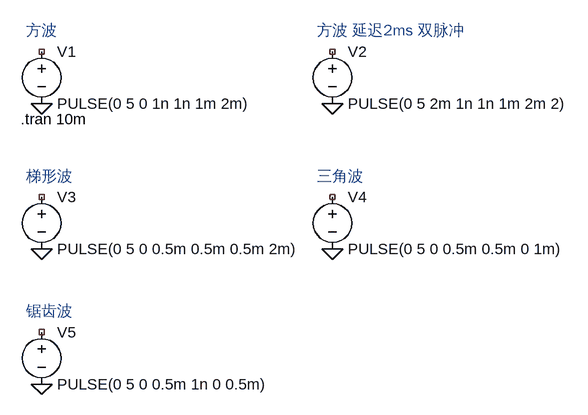
[diagram p0: schematic 04.方波三角波锯齿波.asc]
04.方波三角波锯齿波.asc, the LTspice schematic file:
Version 4
SHEET 1 900 680
FLAG 32 176 0
FLAG 480 176 0
FLAG 32 400 0
FLAG 480 400 0
FLAG 32 608 0
SYMBOL voltage 32 80 R0
WINDOW 123 0 0 Left 0
WINDOW 39 0 0 Left 0
SYMATTR InstName V1
SYMATTR Value PULSE(0 5 0 1n 1n 1m 2m)
SYMBOL voltage 480 80 R0
WINDOW 123 0 0 Left 0
WINDOW 39 0 0 Left 0
SYMATTR InstName V2
SYMATTR Value PULSE(0 5 2m 1n 1n 1m 2m 2)
SYMBOL voltage 32 304 R0
WINDOW 123 0 0 Left 0
WINDOW 39 0 0 Left 0
SYMATTR InstName V3
SYMATTR Value PULSE(0 5 0 0.5m 0.5m 0.5m 2m)
SYMBOL voltage 480 304 R0
WINDOW 123 0 0 Left 0
WINDOW 39 0 0 Left 0
SYMATTR InstName V4
SYMATTR Value PULSE(0 5 0 0.5m 0.5m 0 1m)
SYMBOL voltage 32 512 R0
WINDOW 123 0 0 Left 0
WINDOW 39 0 0 Left 0
SYMATTR InstName V5
SYMATTR Value PULSE(0 5 0 0.5m 1n 0 0.5m)
TEXT 8 64 Left 2 ;方波
TEXT 0 200 Left 2 !.tran 10m
TEXT 456 64 Left 2 ;方波 延迟2ms 双脉冲
TEXT 8 288 Left 2 ;梯形波
TEXT 456 288 Left 2 ;三角波
TEXT 8 496 Left 2 ;锯齿波

The netlist it stands for:
* 04.方波三角波锯齿波.asc
V1 NC_01 0 PULSE(0 5 0 1n 1n 1m 2m)
V2 NC_02 0 PULSE(0 5 2m 1n 1n 1m 2m 2)
V3 NC_03 0 PULSE(0 5 0 0.5m 0.5m 0.5m 2m)
V4 NC_04 0 PULSE(0 5 0 0.5m 0.5m 0 1m)
V5 NC_05 0 PULSE(0 5 0 0.5m 1n 0 0.5m)
* 方波
.tran 10m
* 方波 延迟2ms 双脉冲
* 梯形波
* 三角波
* 锯齿波
.backanno
.end